# Altium project CTTM_LOADCELL_PCB.PrjPcb
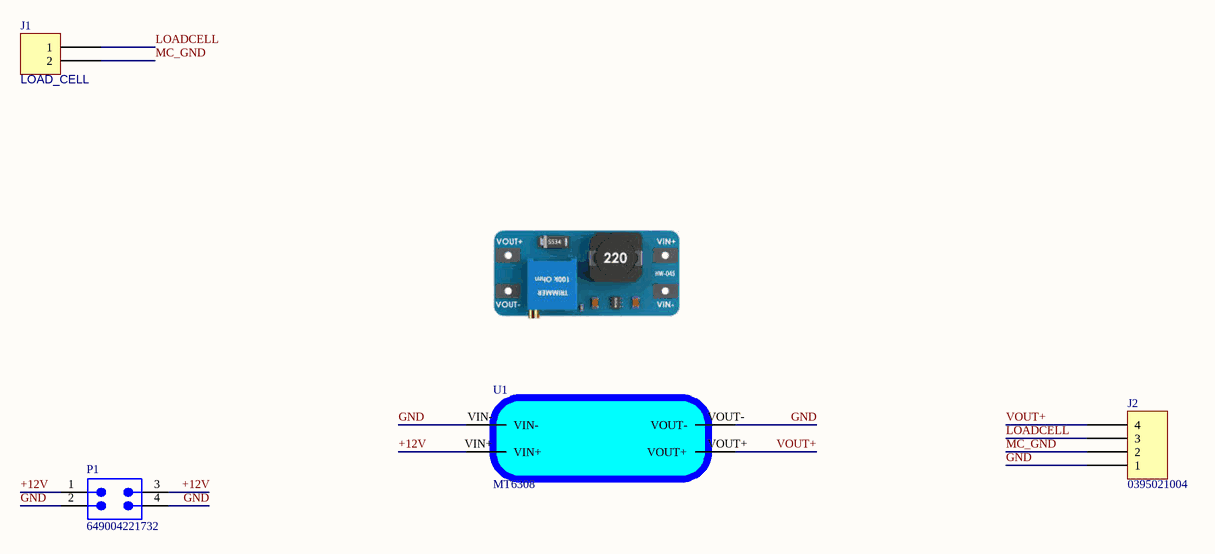
[diagram p0: LOADCELL_SCH.SchDoc]
1 sheet, 4 parts. Net scope: global (net labels, ports and power ports of the same name join across sheets).
Board file: LOADCELL_PCB.PcbDoc

## Sheet LOADCELL_SCH.SchDoc
size A; Engineer: Ibrar Ahmad; SheetNumber: 1; SheetTotal: 1

### Parts
J1  LOAD_CELL  [SAMTEC SSW-102-03-T-S]
J2  0395021004  [MOLEX 395021004]
P1  649004221732  [649004221732]
U1  MT6308  [PCBComponent_1]

### Nets
+12V: P1.1 P1.3 U1.VIN+
GND: J2.1 P1.2 P1.4 U1.VIN- U1.VOUT-
LOADCELL: J1.1 J2.3
MC_GND: J1.2 J2.2
VOUT+: J2.4 U1.VOUT+

### Library data of the parts
J1 = SSW-102-03-T-S: CONN RCPT 2POS 0.1 TIN PCB; Manufacturer: Samtec Inc.; Connector Type: Receptacle; Current Rating (Amps): 5.7A per Contact; Material Flammability Rating: UL94 V-0; Number of Positions: 2; Number of Positions Loaded: All; Style: Board to Board or Cable; Part Number: SSW-102-03-T-S; ComponentLink2Description: DigiKey Link; ComponentLink2URL: http://digikey.com/product-detail/en/samtec-inc/SSW-102-03-T-S/SSW-102-03-T-S-ND/7873010; Contact Finish - Mating: Tin; Contact Finish - Post: Tin; Contact Type: Forked; Fastening Type: Push-Pull; Insulation Color: Black; LastUpdated: 6/21/2022 3:06:02 PM; Lifecycle Status: Active; Minimum Order: 1; Mounting Type: Through Hole; Number of Rows: 1; Operating Temperature: -55°C ~ 105°C; Packaging: Bulk; Part Status: Active; Price: 0.53; Series: SSW; Supplier 1: DigiKey; Supplier Part Number 1: SSW-102-03-T-S-ND; Termination: Solder
J2 = 0395021004: TERM BLOCK HDR 4POS 90DEG 3.5MM; Manufacturer: Molex; Current - UL: 8A; Header Orientation: 90°, Right Angle; Number of Levels: 1; Number of Positions: 4; Pitch: 0.138" (3.50mm); Voltage - UL: 300V; Part Number: 0395021004; Color: Black; ComponentLink1Description: Datasheet; ComponentLink1URL: https://www.molex.com/pdm_docs/sd/395021002_sd.pdf; ComponentLink2Description: DigiKey Link; ComponentLink2URL: http://digikey.com/product-detail/en/molex/0395021004/WM7772-ND/1280623; Contact Mating Finish: Tin; LastUpdated: 6/25/2020 3:44:36 PM; Lifecycle Status: Active; Minimum Order: 1; Mounting Type: Through Hole; Operating Temperature: -40°C ~ 105°C; Packaging: Tray; Part Status: Active; Positions Per Level: 4; Price: 1.07; Series: Eurostyle ESE 39502; Supplier 1: DigiKey; Supplier Part Number 1: WM7772-ND; Termination Style: Solder; Type: Header, Male Pins, Shrouded (4 Side)
P1 = CMP-1502-00506-2: NexarPartId: 23024601; Current Rating: 8A; Contact Resistance: 10mΩ; Gender: Male; Number of Contacts: 4; Insulation Resistance: 1GΩ; Row Spacing: 4.191mm; Operating Supply Voltage: 600V; Connector Type: Male Pin, Plug; Pitch: 4.2mm; Number of Pins: 4; Width: 9.6mm; Lead Pitch: 4.2mm; REACH SVHC: Unknown; Orientation: Vertical; Length: 9.6mm; Max Operating Temperature: 105°C; Min Operating Temperature: -40°C; Color: White; Contact Material: Copper; Termination: Solder; RoHS: Compliant; Fastening Type: Ramp; Contact Plating: Tin; Number of Positions: 4; Mount: Through Hole; Number of Rows: 2; Height: 12.8mm
U1 = U